# EAGLE design openmv (EAGLE 6.1)
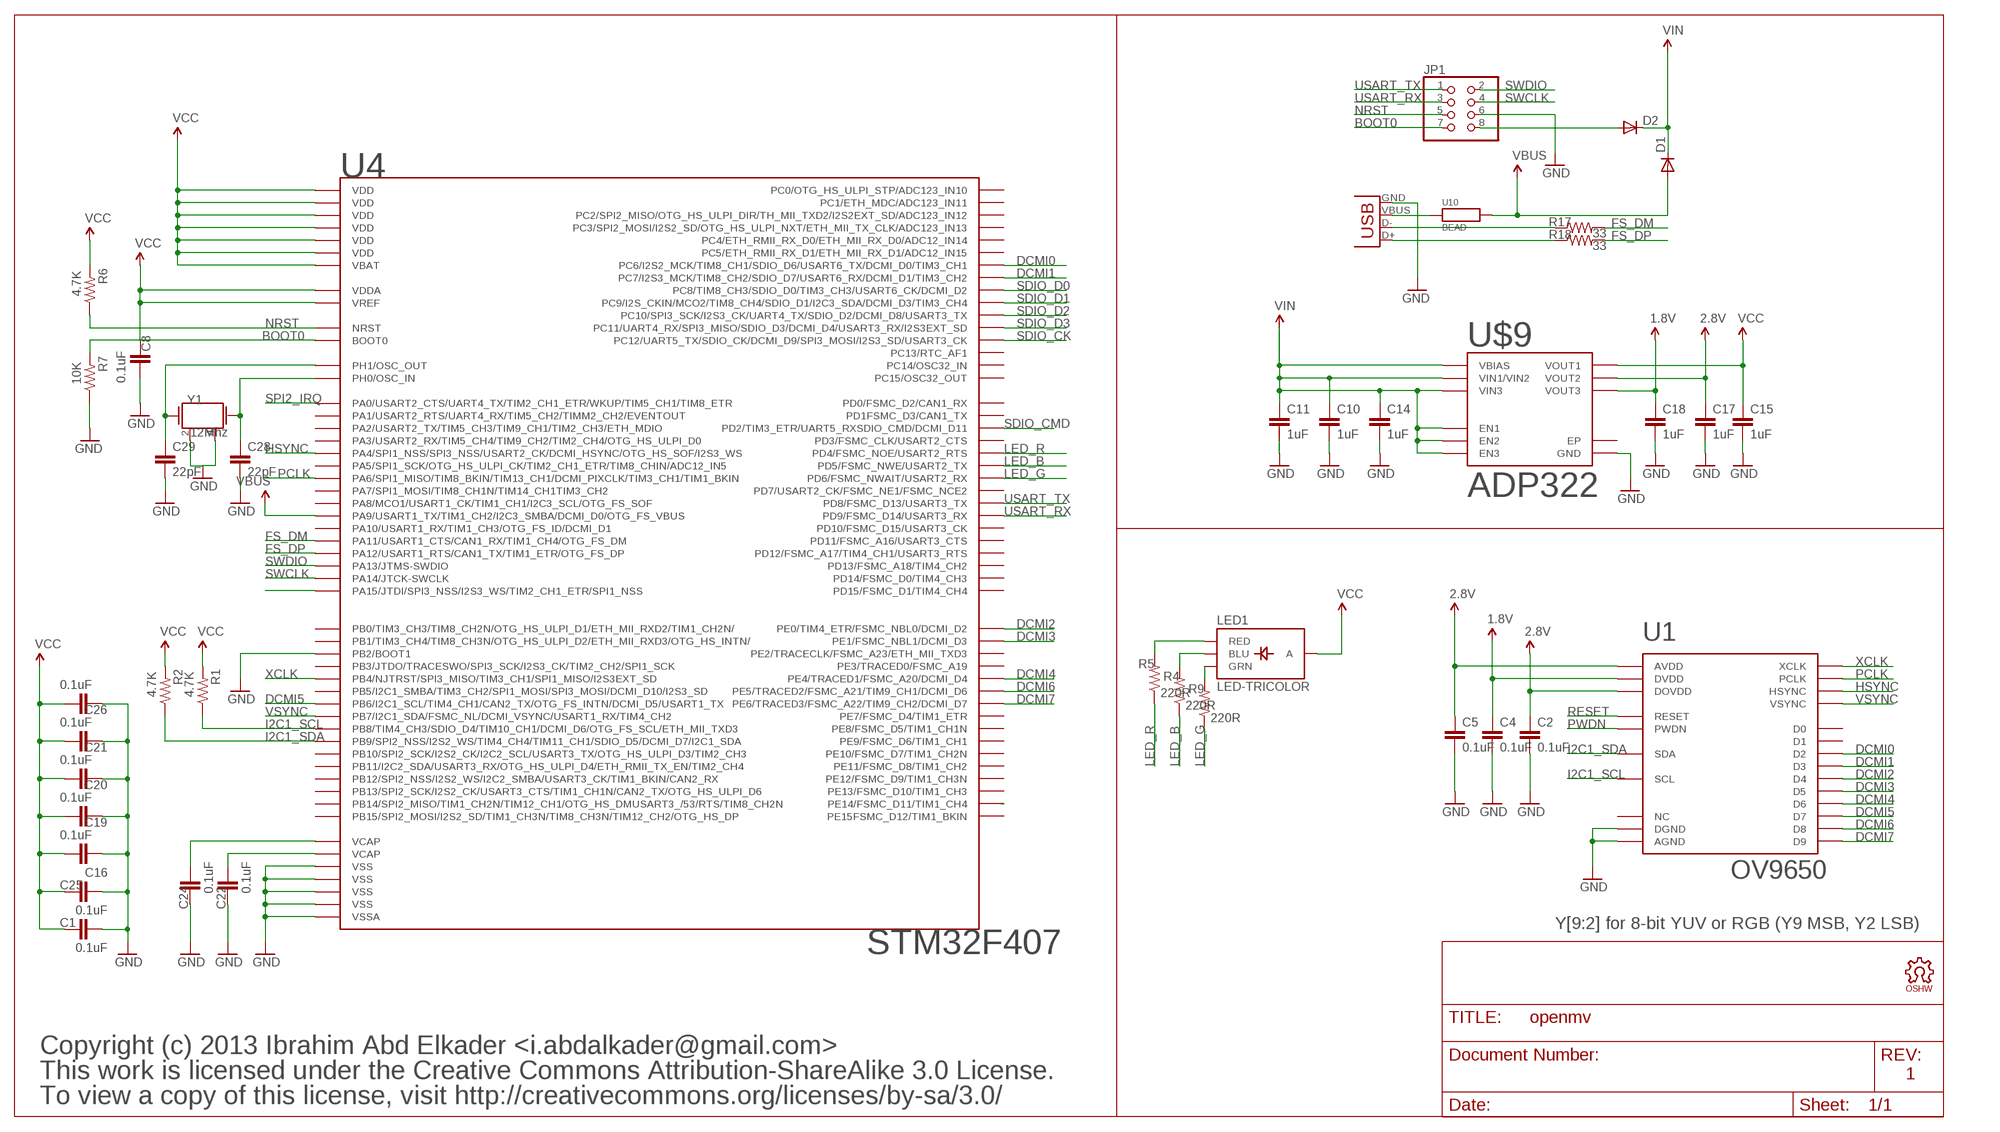
[diagram p0: schematic, sheet 1]

## Parts
C1  0.1uF  CAP0402-CAP  [0402-CAP]
C2  0.1uF  CAP0402-CAP  [0402-CAP]
C4  0.1uF  CAP0402-CAP  [0402-CAP]
C5  0.1uF  CAP0402-CAP  [0402-CAP]
C8  0.1uF  CAP0402-CAP  [0402-CAP]
C10  1uF  CAP0402-CAP  [0402-CAP]
C11  1uF  CAP0402-CAP  [0402-CAP]
C14  1uF  CAP0402-CAP  [0402-CAP]
C15  1uF  CAP0402-CAP  [0402-CAP]
C16  0.1uF  CAP0402-CAP  [0402-CAP]
C17  1uF  CAP0402-CAP  [0402-CAP]
C18  1uF  CAP0402-CAP  [0402-CAP]
C19  0.1uF  CAP0402-CAP  [0402-CAP]
C20  0.1uF  CAP0402-CAP  [0402-CAP]
C21  0.1uF  CAP0402-CAP  [0402-CAP]
C22  0.1uF  CAP0402-CAP  [0402-CAP]
C24  0.1uF  CAP0402-CAP  [0402-CAP]
C25  0.1uF  CAP0402-CAP  [0402-CAP]
C26  0.1uF  CAP0402-CAP  [0402-CAP]
C28  22pF  CAP0402-CAP  [0402-CAP]
C29  22pF  CAP0402-CAP  [0402-CAP]
D1  DIODESOD  [SOD-323]
D2  DIODESOD  [SOD-323]
JP1  PINHD-2X4  [2X04]
LED1  LED-TRICOLOR  [LED-TRICOLOR-SMD]
LOGO2  OSHW_LOGO_FILLX0100-NT  [OSHW_FILLX100_NOTEXT]
R1  4.7K  RESISTOR0402-RES  [0402-RES]
R2  4.7K  RESISTOR0402-RES  [0402-RES]
R4  220R  RESISTOR0402-RES  [0402-RES]
R5  220R  RESISTOR0402-RES  [0402-RES]
R6  4.7K  RESISTOR0402-RES  [0402-RES]
R7  10K  RESISTOR0402-RES  [0402-RES]
R9  220R  RESISTOR0402-RES  [0402-RES]
R17  33  RESISTOR0402-RES  [0402-RES]
R18  33  RESISTOR0402-RES  [0402-RES]
U1  OV9650  [OV9650]
U4  STM32F407  [LQFP100]
U10  BEAD  [0402-CAP]
U$9  ADP322  [WFQFN-16]
X2  USB-MICROB  [USB-MICROB]
Y1  12Mhz  CRYSTAL5X3  [CRYSTAL-SMD-5X3]

## Nets
1.8V: C4.1 C18.1 U1.P$10(DVDD) U$9.8(VOUT3)
2.8V: C2.1 C5.1 C17.1 U1.P$4(AVDD) U1.P$11(DOVDD) U$9.6(VOUT2)
BOOT0: JP1.7 R7.2 U4.94(BOOT0)
DCMI0: U1.P$19(D2) U4.63(PC6/I2S2_MCK/TIM8_CH1/SDIO_D6/USART6_TX/DCMI_D0/TIM3_CH1)
DCMI1: U1.P$21(D3) U4.64(PC7/I2S3_MCK/TIM8_CH2/SDIO_D7/USART6_RX/DCMI_D1/TIM3_CH2)
DCMI2: U1.P$22(D4) U4.97(PE0/TIM4_ETR/FSMC_NBL0/DCMI_D2)
DCMI3: U1.P$20(D5) U4.98(PE1/FSMC_NBL1/DCMI_D3)
DCMI4: U1.P$18(D6) U4.3(PE4/TRACED1/FSMC_A20/DCMI_D4)
DCMI5: U1.P$16(D7) U4.92(PB6/I2C1_SCL/TIM4_CH1/CAN2_TX/OTG_FS_INTN/DCMI_D5/USART1_TX)
DCMI6: U1.P$14(D8) U4.4(PE5/TRACED2/FSMC_A21/TIM9_CH1/DCMI_D6)
DCMI7: U1.P$12(D9) U4.5(PE6/TRACED3/FSMC_A22/TIM9_CH2/DCMI_D7)
FS_DM: R17.2 U4.70(PA11/USART1_CTS/CAN1_RX/TIM1_CH4/OTG_FS_DM)
FS_DP: R18.2 U4.71(PA12/USART1_RTS/CAN1_TX/TIM1_ETR/OTG_FS_DP)
GND: C1.1 C2.2 C4.2 C5.2 C8.1 C10.2 C11.2 C14.2 C15.2 C16.1 C17.2 C18.2 C19.2 C20.2 C21.2 C22.2 C24.2 C25.1 C26.2 C28.2 C29.2 JP1.6 R7.1 U1.P$2(AGND) U1.P$15(DGND) U4.10(VSS) U4.20(VSSA) U4.27(VSS) U4.37(PB2/BOOT1) U4.74(VSS) U4.99(VSS) U$9.12(GND) X2.GND Y1.2 Y1.4
HSYNC: U1.P$9(HSYNC) U4.29(PA4/SPI1_NSS/SPI3_NSS/USART2_CK/DCMI_HSYNC/OTG_HS_SOF/I2S3_WS)
I2C1_SCL: R1.1 U1.P$5(SCL) U4.95(PB8/TIM4_CH3/SDIO_D4/TIM10_CH1/DCMI_D6/OTG_FS_SCL/ETH_MII_TXD3)
I2C1_SDA: R2.1 U1.P$3(SDA) U4.96(PB9/SPI2_NSS/I2S2_WS/TIM4_CH4/TIM11_CH1/SDIO_D5/DCMI_D7/I2C1_SDA)
LED_B: R4.1 U4.86(PD5/FSMC_NWE/USART2_TX)
LED_G: R9.1 U4.87(PD6/FSMC_NWAIT/USART2_RX)
LED_R: R5.1 U4.85(PD4/FSMC_NOE/USART2_RTS)
N$1: D2.2(A) JP1.8
N$2: U4.77(PA15/JTDI/SPI3_NSS/I2S3_WS/TIM2_CH1_ETR/SPI1_NSS)
N$6: LED1.G(GRN) R9.2
N$7: LED1.B(BLU) R4.2
N$9: C29.1 U4.13(PH1/OSC_OUT) Y1.1
N$10: C28.1 U4.12(PH0/OSC_IN) Y1.3
N$16: LED1.R(RED) R5.2
N$18: U4.45(PE14/FSMC_D11/TIM1_CH4)
N$20: R17.1 X2.D-
N$21: R18.1 X2.D+
N$22: U10.1 X2.VBUS
NRST: JP1.5 R6.1 U4.14(NRST)
PCLK: U1.P$17(PCLK) U4.31(PA6/SPI1_MISO/TIM8_BKIN/TIM13_CH1/DCMI_PIXCLK/TIM3_CH1/TIM1_BKIN)
PWDN: U1.P$8(PWDN)
RESET: U1.P$6(RESET)
SDIO_CK: U4.80(PC12/UART5_TX/SDIO_CK/DCMI_D9/SPI3_MOSI/I2S3_SD/USART3_CK)
SDIO_CMD: U4.83(PD2/TIM3_ETR/UART5_RXSDIO_CMD/DCMI_D11)
SDIO_D0: U4.65(PC8/TIM8_CH3/SDIO_D0/TIM3_CH3/USART6_CK/DCMI_D2)
SDIO_D1: U4.66(PC9/I2S_CKIN/MCO2/TIM8_CH4/SDIO_D1/I2C3_SDA/DCMI_D3/TIM3_CH4)
SDIO_D2: U4.78(PC10/SPI3_SCK/I2S3_CK/UART4_TX/SDIO_D2/DCMI_D8/USART3_TX)
SDIO_D3: U4.79(PC11/UART4_RX/SPI3_MISO/SDIO_D3/DCMI_D4/USART3_RX/I2S3EXT_SD)
SPI2_IRQ: U4.23(PA0/USART2_CTS/UART4_TX/TIM2_CH1_ETR/WKUP/TIM5_CH1/TIM8_ETR)
SWCLK: JP1.4 U4.76(PA14/JTCK-SWCLK)
SWDIO: JP1.2 U4.72(PA13/JTMS-SWDIO)
USART_RX: JP1.3 U4.56(PD9/FSMC_D14/USART3_RX)
USART_TX: JP1.1 U4.55(PD8/FSMC_D13/USART3_TX)
VBUS: D1.2(A) U4.68(PA9/USART1_TX/TIM1_CH2/I2C3_SMBA/DCMI_D0/OTG_FS_VBUS) U10.2
VCAP1: C24.1 U4.49(VCAP)
VCAP2: C22.1 U4.73(VCAP)
VCC: C1.2 C8.2 C15.1 C16.2 C19.1 C20.1 C21.1 C25.2 C26.1 LED1.A R1.2 R2.2 R6.2 U4.6(VBAT) U4.11(VDD) U4.19(VDD) U4.21(VREF) U4.22(VDDA) U4.28(VDD) U4.50(VDD) U4.75(VDD) U4.100(VDD) U$9.5(VOUT1)
VIN: C10.1 C11.1 C14.1 D1.1(C) D2.1(C) U$9.1(EN1) U$9.2(VBIAS) U$9.3(VIN1/VIN2) U$9.10(VIN3) U$9.15(EN3) U$9.16(EN2)
VSYNC: U1.P$7(VSYNC) U4.93(PB7/I2C1_SDA/FSMC_NL/DCMI_VSYNC/USART1_RX/TIM4_CH2)
XCLK: U1.P$13(XCLK) U4.90(PB4/NJTRST/SPI3_MISO/TIM3_CH1/SPI1_MISO/I2S3EXT_SD)
Unconnected: U1.P$1(NC) U1.P$23(D1) U1.P$24(D0) U4.1(PE2/TRACECLK/FSMC_A23/ETH_MII_TXD3) U4.2(PE3/TRACED0/FSMC_A19) U4.7(PC13/RTC_AF1) U4.8(PC14/OSC32_IN) U4.9(PC15/OSC32_OUT) U4.15(PC0/OTG_HS_ULPI_STP/ADC123_IN10) U4.16(PC1/ETH_MDC/ADC123_IN11) U4.17(PC2/SPI2_MISO/OTG_HS_ULPI_DIR/TH_MII_TXD2/I2S2EXT_SD/ADC123_IN12) U4.18(PC3/SPI2_MOSI/I2S2_SD/OTG_HS_ULPI_NXT/ETH_MII_TX_CLK/ADC123_IN13) U4.24(PA1/USART2_RTS/UART4_RX/TIM5_CH2/TIMM2_CH2/EVENTOUT) U4.25(PA2/USART2_TX/TIM5_CH3/TIM9_CH1/TIM2_CH3/ETH_MDIO) U4.26(PA3/USART2_RX/TIM5_CH4/TIM9_CH2/TIM2_CH4/OTG_HS_ULPI_D0) U4.30(PA5/SPI1_SCK/OTG_HS_ULPI_CK/TIM2_CH1_ETR/TIM8_CHIN/ADC12_IN5) U4.32(PA7/SPI1_MOSI/TIM8_CH1N/TIM14_CH1TIM3_CH2) U4.33(PC4/ETH_RMII_RX_D0/ETH_MII_RX_D0/ADC12_IN14) U4.34(PC5/ETH_RMII_RX_D1/ETH_MII_RX_D1/ADC12_IN15) U4.35(PB0/TIM3_CH3/TIM8_CH2N/OTG_HS_ULPI_D1/ETH_MII_RXD2/TIM1_CH2N/) U4.36(PB1/TIM3_CH4/TIM8_CH3N/OTG_HS_ULPI_D2/ETH_MII_RXD3/OTG_HS_INTN/) U4.38(PE7/FSMC_D4/TIM1_ETR) U4.39(PE8/FSMC_D5/TIM1_CH1N) U4.40(PE9/FSMC_D6/TIM1_CH1) U4.41(PE10/FSMC_D7/TIM1_CH2N) U4.42(PE11/FSMC_D8/TIM1_CH2) U4.43(PE12/FSMC_D9/TIM1_CH3N) U4.44(PE13/FSMC_D10/TIM1_CH3) U4.46(PE15FSMC_D12/TIM1_BKIN) U4.47(PB10/SPI2_SCK/I2S2_CK/I2C2_SCL/USART3_TX/OTG_HS_ULPI_D3/TIM2_CH3) U4.48(PB11/I2C2_SDA/USART3_RX/OTG_HS_ULPI_D4/ETH_RMII_TX_EN/TIM2_CH4) U4.51(PB12/SPI2_NSS/I2S2_WS/I2C2_SMBA/USART3_CK/TIM1_BKIN/CAN2_RX) U4.52(PB13/SPI2_SCK/I2S2_CK/USART3_CTS/TIM1_CH1N/CAN2_TX/OTG_HS_ULPI_D6) U4.53(PB14/SPI2_MISO/TIM1_CH2N/TIM12_CH1/OTG_HS_DMUSART3_/53/RTS/TIM8_CH2N) U4.54(PB15/SPI2_MOSI/I2S2_SD/TIM1_CH3N/TIM8_CH3N/TIM12_CH2/OTG_HS_DP) U4.57(PD10/FSMC_D15/USART3_CK) U4.58(PD11/FSMC_A16/USART3_CTS) U4.59(PD12/FSMC_A17/TIM4_CH1/USART3_RTS) U4.60(PD13/FSMC_A18/TIM4_CH2) U4.61(PD14/FSMC_D0/TIM4_CH3) U4.62(PD15/FSMC_D1/TIM4_CH4) U4.67(PA8/MCO1/USART1_CK/TIM1_CH1/I2C3_SCL/OTG_FS_SOF) U4.69(PA10/USART1_RX/TIM1_CH3/OTG_FS_ID/DCMI_D1) U4.81(PD0/FSMC_D2/CAN1_RX) U4.82(PD1FSMC_D3/CAN1_TX) U4.84(PD3/FSMC_CLK/USART2_CTS) U4.88(PD7/USART2_CK/FSMC_NE1/FSMC_NCE2) U4.89(PB3/JTDO/TRACESWO/SPI3_SCK/I2S3_CK/TIM2_CH2/SPI1_SCK) U4.91(PB5/I2C1_SMBA/TIM3_CH2/SPI1_MOSI/SPI3_MOSI/DCMI_D10/I2S3_SD) U$9.4(NC) U$9.7(NC) U$9.9(NC) U$9.11(NC) U$9.13(NC) U$9.14(NC) U$9.EXP(EP)

## Notes on the sheet
- Y[9:2] for 8-bit YUV or RGB (Y9 MSB, Y2 LSB)
- Copyright (c) 2013 Ibrahim Abd Elkader <i.abdalkader@gmail.com>
- This work is licensed under the Creative Commons Attribution-ShareAlike 3.0 License. | 1
- To view a copy of this license, visit http://creativecommons.org/licenses/by-sa/3.0/

## Library data of the parts
C1 C2 C4 C5 C8 C10 C11 C14-C22 C24-C26 C28 C29 = sfe:CAP: Capacitor Standard 0603 ceramic capacitor, and 0.1" leaded capacitor.
D1 D2 = sfe:DIODE: Diode These are standard reverse protection diodes and small signal diodes. SMA package can handle up to about 1A. SOD-323 can handle about 200mA. What the SOD-323 package when ordering, there are some mfgs out there that are 5-pin packages.
JP1 = pinhead:PINHD-2X4: PIN HEADER
LED1 = sfe:LED-TRICOLOR: Tri-Color LED SMD Proven layout and schematic for triple color LED in SMD package - common anode. Spark Fun Electronics SKU : COM-07844
LOGO2 = iofault:OSHW_LOGO_FILL
R1 R2 R4-R7 R9 R17 R18 = sfe:RESISTOR: Resistor Basic schematic elements and footprints for 0603, 1206, and PTH resistors.
U1 = iofault:OV9650
U4 = mux:STM32F407
U10 = heka:BEAD
U$9 = iofault:ADP322
X2 = sfe:USB: USB Connectors USB-B-PTH is fully proven SKU : PRT-00139 USB-miniB is fully proven SKU : PRT-00587 USB-A-PCB is untested. USB-A-H is throughly reviewed, but untested. Spark Fun Electronics SKU : PRT-00437 USB-B-SMT is throughly reviewed, but untested. Needs silkscreen touching up. USB-A-S has not been used/tested USB-MB-H has not been used/tested
Y1 = mux:CRYSTAL: Crystals Various standard crystals. Proven footprints. Spark Fun Electronics SKU : COM-00534

## Board
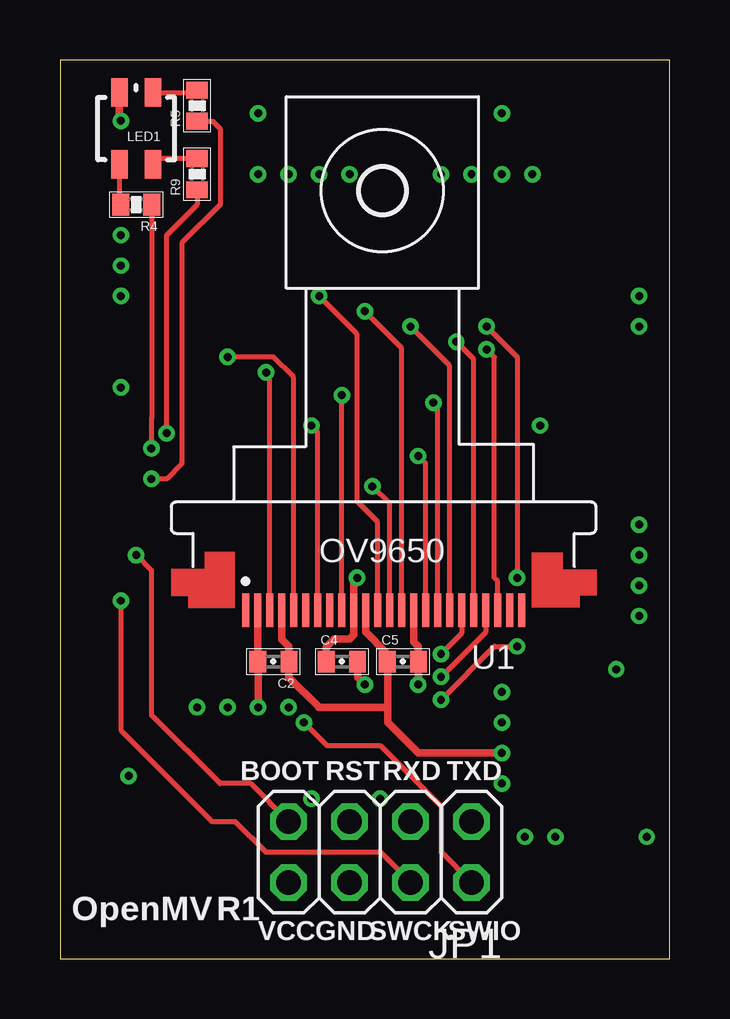
[diagram p1: board, top side]
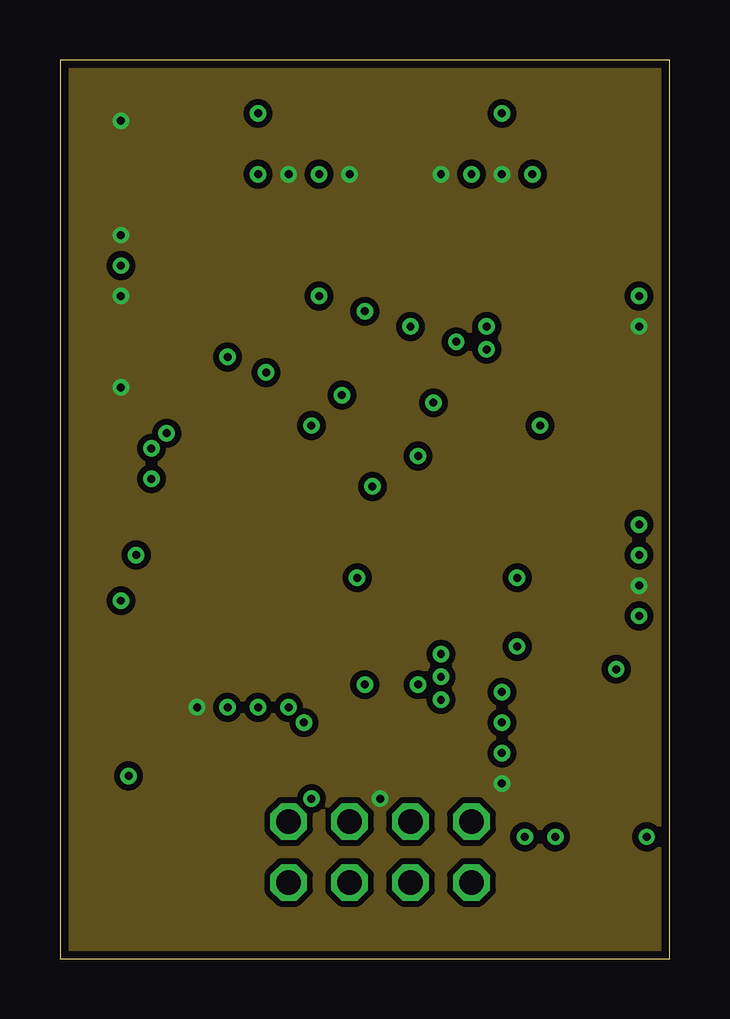
[diagram p2: board, inner layer Route2]
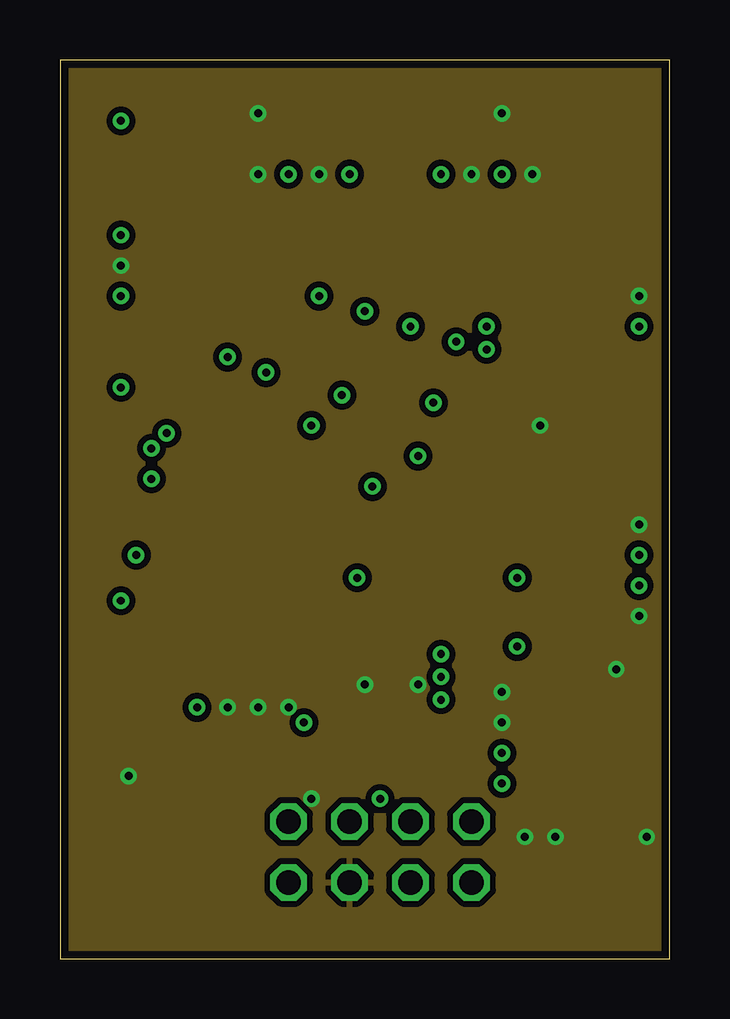
[diagram p3: board, inner layer Route15]
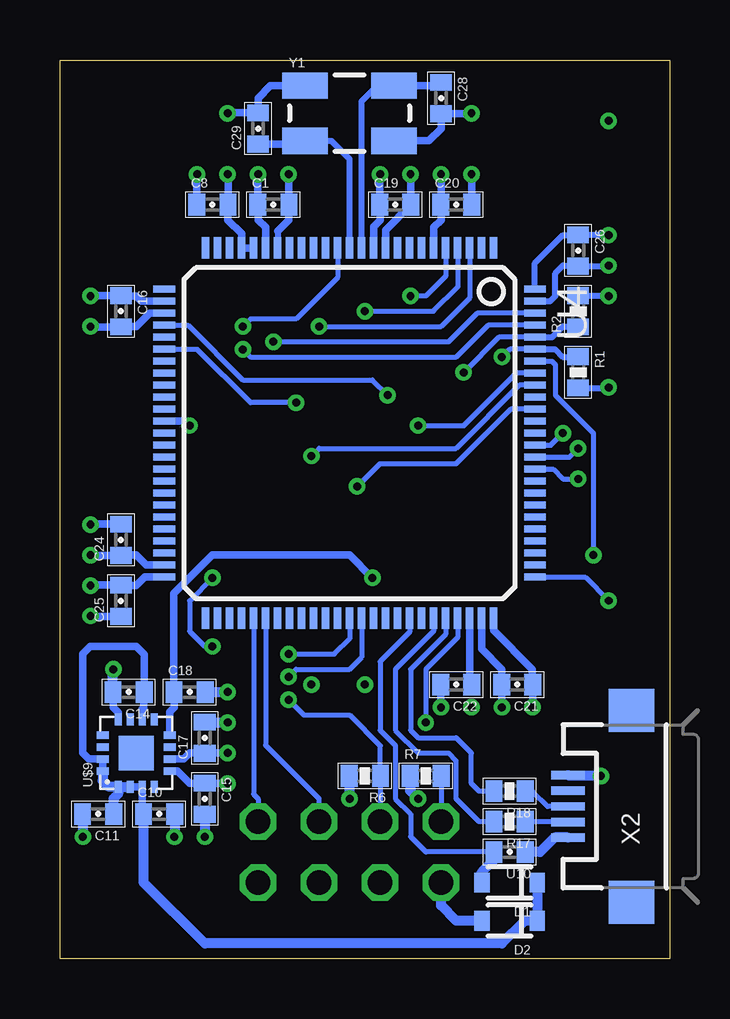
[diagram p4: board, bottom side, seen from below]

Size 25.4 x 37.47 mm. Coordinates in mm from the lower left corner, seen from the top.
Outline: 0,0 25.4,0 25.4,37.47 0,37.47 0,0
Copper layers (1*2+15*16): Top 0.035mm / dielectric 1.5mm / Route2 0.035mm / dielectric 0.15mm / Route15 0.035mm / dielectric 0.2mm / Bottom 0.035mm
Design rules: minimum track width 8mil, minimum drill 13mil, track to track 6mil, track to pad 6mil, pad to pad 6mil, via to via 6mil, smd to smd 6mil, copper to edge 13mil, drill to drill 13mil, minimum pad ring 10mil, minimum via ring 7mil, stop-mask expansion 2mil, vias tented up to drill 20mil, thermal gap 10mil

### Footprints (pad centres in the part's own frame; a part is rotated, then mirrored left to right if it is on the bottom)
0402-CAP = smd 0.7 x 0.9: 1 -0.65,0; 2 0.65,0
SOD-323 = smd 0.63 x 0.83: 1 -1.15,0; 2 1.15,0
2X04 = drill 1.016 octagon: 1 -3.81,-1.27; 2 -3.81,1.27; 3 -1.27,-1.27; 4 -1.27,1.27; 5 1.27,-1.27; 6 1.27,1.27; 7 3.81,-1.27; 8 3.81,1.27
LED-TRICOLOR-SMD = smd 0.7 x 1.2: A 0.7,-1.5; B 0.7,1.5; G -0.7,1.5; R -0.7,-1.5
0402-RES = smd 0.7 x 0.9: 1 -0.65,0; 2 0.65,0
OV9650 = smd 0.3 x 1.4: P$1 -5.6,-11.5; P$2 -5.1,-11.5; P$3 -4.6,-11.5; P$4 -4.1,-11.5; P$5 -3.6,-11.5; P$6 -3.1,-11.5; P$7 -2.6,-11.5; P$8 -2.1,-11.5; P$9 -1.6,-11.5; P$10 -1.1,-11.5; P$11 -0.6,-11.5; P$12 -0.1,-11.5; P$13 0.4,-11.5; P$14 0.9,-11.5; P$15 1.4,-11.5; P$16 1.9,-11.5; P$17 2.4,-11.5; P$18 2.9,-11.5; P$19 3.4,-11.5; P$20 3.9,-11.5; P$21 4.4,-11.5; P$22 4.9,-11.5; P$23 5.4,-11.5; P$24 5.9,-11.5
LQFP100 = smd 0.9 x 0.3: 1 -7.72,6; 2 -7.72,5.5; 3 -7.72,5; 4 -7.72,4.5; 5 -7.72,4; 6 -7.72,3.5; 7 -7.72,3; 8 -7.72,2.5; 9 -7.72,2; 10 -7.72,1.5; 11 -7.72,1; 12 -7.72,0.5; 13 -7.72,0; 14 -7.72,-0.5; 15 -7.72,-1; 16 -7.72,-1.5; 17 -7.72,-2; 18 -7.72,-2.5; 19 -7.72,-3; 20 -7.72,-3.5; 21 -7.72,-4; 22 -7.72,-4.5; 23 -7.72,-5; 24 -7.72,-5.5; 25 -7.72,-6; 51 7.72,-6; 52 7.72,-5.5; 53 7.72,-5; 54 7.72,-4.5; 55 7.72,-4; 56 7.72,-3.5; 57 7.72,-3; 58 7.72,-2.5; 59 7.72,-2; 60 7.72,-1.5; 61 7.72,-1; 62 7.72,-0.5; 63 7.72,0; 64 7.72,0.5; 65 7.72,1; 66 7.72,1.5; 67 7.72,2; 68 7.72,2.5; 69 7.72,3; 70 7.72,3.5; 71 7.72,4; 72 7.72,4.5; 73 7.72,5; 74 7.72,5.5; 75 7.72,6 | smd 0.3 x 0.9: 26 -6,-7.72; 27 -5.5,-7.72; 28 -5,-7.72; 29 -4.5,-7.72; 30 -4,-7.72; 31 -3.5,-7.72; 32 -3,-7.72; 33 -2.5,-7.72; 34 -2,-7.72; 35 -1.5,-7.72; 36 -1,-7.72; 37 -0.5,-7.72; 38 0,-7.72; 39 0.5,-7.72; 40 1,-7.72; 41 1.5,-7.72; 42 2,-7.72; 43 2.5,-7.72; 44 3,-7.72; 45 3.5,-7.72; 46 4,-7.72; 47 4.5,-7.72; 48 5,-7.72; 49 5.5,-7.72; 50 6,-7.72; 76 6,7.72; 77 5.5,7.72; 78 5,7.72; 79 4.5,7.72; 80 4,7.72; 81 3.5,7.72; 82 3,7.72; 83 2.5,7.72; 84 2,7.72; 85 1.5,7.72; 86 1,7.72; 87 0.5,7.72; 88 0,7.72; 89 -0.5,7.72; 90 -1,7.72; 91 -1.5,7.72; 92 -2,7.72; 93 -2.5,7.72; 94 -3,7.72; 95 -3.5,7.72; 96 -4,7.72; 97 -4.5,7.72; 98 -5,7.72; 99 -5.5,7.72; 100 -6,7.72
WFQFN-16 = smd 0.5 x 0.3: 1 -1.4,0.75; 2 -1.4,0.25; 3 -1.4,-0.25; 4 -1.4,-0.75; 9 1.4,-0.75; 10 1.4,-0.25; 11 1.4,0.25; 12 1.4,0.75 | smd 0.3 x 0.5: 5 -0.75,-1.4; 6 -0.25,-1.4; 7 0.25,-1.4; 8 0.75,-1.4; 13 0.75,1.4; 14 0.25,1.4; 15 -0.25,1.4; 16 -0.75,1.4 | smd 1.45 x 1.45: EXP 0,0
USB-MICROB = smd 0.35 x 1.4: D+ 0,2.65; D- -0.65,2.65; GND 1.3,2.65; ID 0.65,2.65; VBUS -1.3,2.65 | smd 1.8 x 1.9: MT1 -4,0; MT2 4,0
CRYSTAL-SMD-5X3 = smd 1.9 x 1.1: 1 -1.85,-1.15; 2 1.85,-1.15; 3 1.85,1.15; 4 -1.85,1.15

### Placement (x,y rotation side)
C1  16.51,31.43 0 bottom
C2  8.89,12.38 180 top
C4  11.75,12.38 0 top
C5  14.29,12.38 0 top
C8  19.05,31.43 0 bottom
C10  21.27,6.03 0 bottom
C11  23.81,6.03 180 bottom
C14  22.54,11.11 180 bottom
C15  19.37,6.67 270 bottom
C16  22.86,26.99 270 bottom
C17  19.37,9.21 90 bottom
C18  20,11.11 0 bottom
C19  11.43,31.43 0 bottom
C20  8.89,31.43 0 bottom
C21  6.35,11.43 180 bottom
C22  8.89,11.43 180 bottom
C24  22.86,17.46 90 bottom
C25  22.86,14.92 90 bottom
C26  3.81,29.53 270 bottom
C28  9.53,35.88 270 bottom
C29  17.14,34.61 90 bottom
D1  6.67,3.17 180 bottom
D2  6.67,1.59 180 bottom
JP1  13.34,4.45 180 top
LED1  3.17,34.61 180 top
LOGO2  -0.95,-9.53 0 top  (outside the outline)
R1  3.81,24.45 270 bottom
R2  3.81,26.99 90 bottom
R4  3.17,31.43 180 top
R5  5.71,35.56 90 top
R6  12.7,7.62 180 bottom
R7  10.16,7.62 0 bottom
R9  5.71,32.7 90 top
R17  6.67,5.71 180 bottom
R18  6.67,6.99 180 bottom
U1  13.34,26.04 0 top
U4  13.34,21.91 270 bottom
U10  6.67,4.45 180 bottom
U$9  22.23,8.57 90 bottom
X2  1.59,6.35 90 bottom
Y1  13.34,35.24 0 bottom

### Tracks (layer width: path | path; a pad name or v marks a point on that pad's centre or on a via)
1.8V  (via drill 0.33)
  Top 0.305: v12.38,15.88 12.23,15.73 U1.P$10 12.23,13.51 12.06,13.34 11.43,13.34 11.1,13 C4.1
  Bottom 0.305: U$9.8 20.82,10.29 20.64,10.48 20.64,11.1 C18.1 20.65,15.22 19.05,16.83 13.34,16.83 v12.38,15.88
2.8V  (via drill 0.33)
  Top 0.305: 13.64,10.49 13.65,10.48 | v18.41,8.57 14.92,8.57 13.65,9.84 13.65,10.48 | 10.79,10.48 9.54,11.73 C2.1 9.53,12.4 9.53,13.02 9.23,13.31 U1.P$4 | 10.79,10.48 10.78,10.48 | 10.79,10.48 13.65,10.48 | U1.P$11 12.73,13.62 13.64,12.71 C5.1 13.65,12.37 13.65,10.48
  Bottom 0.254: 19.38,8.57 C17.1
  Bottom 0.305: U$9.6 20.25,8.32 20,8.57 19.38,8.57 v18.41,8.57
BOOT0  (via drill 0.33)
  Top 0.203: JP1.7 7.94,7.3 6.67,7.3 3.81,10.16 3.81,16.19 v3.17,16.83
  Bottom 0.203: U4.94 4.91,24.91 4.76,24.77 4.76,23.5 3.17,21.91 v3.17,16.83 | R7.2 9.51,5.73 JP1.7
DCMI0  (via drill 0.33)
  Top 0.203: v15.88,12.7 16.73,13.56 U1.P$19
  Bottom 0.203: v15.88,12.7 13.97,12.7 13.34,13.34 U4.63
DCMI1  (via drill 0.33)
  Top 0.203: v15.88,11.75 17.73,13.61 U1.P$21
  Bottom 0.203: v15.88,11.75 15.56,12.06 13.34,12.06 12.84,12.56 U4.64
DCMI2  (via drill 0.33)
  Top 0.203: U1.P$22 18.23,15.74 18.1,15.88 18.1,25.08 v17.78,25.4
  Bottom 0.203: v17.78,25.4 17.46,25.08 8.89,25.08 7.57,26.41 U4.97
DCMI3  (via drill 0.33)
  Top 0.203: U1.P$20 17.23,24.99 v16.51,25.72
  Bottom 0.203: v16.51,25.72 9.21,25.72 8.02,26.91 U4.98
DCMI4  (via drill 0.33)
  Top 0.203: U1.P$18 16.23,24.72 v14.61,26.35
  Bottom 0.203: v14.61,26.35 9.53,26.35 8.34,27.54 U4.3
DCMI5  (via drill 0.33)
  Top 0.203: v14.92,20.95 15.23,20.64 U1.P$16
  Bottom 0.203: v14.92,20.95 14.61,21.27 8.89,21.27 6.25,23.91 U4.92
DCMI6  (via drill 0.33)
  Top 0.203: v12.7,26.99 14.23,25.45 U1.P$14
  Bottom 0.203: v12.7,26.99 9.84,26.99 8.84,28 U4.4
DCMI7  (via drill 0.33)
  Top 0.203: v10.79,27.62 12.38,26.04 12.38,19.05 13.23,18.2 U1.P$12
  Bottom 0.203: U4.5 9.34,28.45 10.16,27.62 v10.79,27.62
FS_DM
  Bottom 0.203: U4.70 9.84,13.66 11.43,12.06 11.43,9.53 10.48,8.57 9.21,8.57 8.89,8.26 8.89,6.67 7.94,5.71 R17.2
FS_DP
  Bottom 0.203: U4.71 9.34,13.53 10.79,12.06 10.79,9.53 10.48,9.21 8.89,9.21 8.26,8.57 8.26,7.3 7.94,6.99 R18.2
GND  (via drill 0.33)
  Top 0.305: C2.2 8.26,12.4 8.26,12.38 | 8.26,12.38 v8.26,10.48 | C4.2 12.4,11.73 v12.7,11.43 | U1.P$2 8.23,12.4 8.26,12.38 | U1.P$15 14.73,13.21 14.92,13.02 14.92,12.4 | 14.92,12.4 C5.2 | 14.92,12.4 v14.92,11.43
  Bottom 0.254: U4.99 4.98,27.41 4.76,27.62 4.76,28.57 4.45,28.89 3.83,28.89 C26.2 2.56,28.88 v2.54,28.89
  Bottom 0.305: U4.27 22.01,27.41 22.23,27.62 22.84,27.62 C16.1 24.11,27.64 v24.13,27.62 | C25.1 24.11,14.27 v24.13,14.29 | C24.2 24.11,18.11 v24.13,18.1 | v6.99,10.48 7,10.49 C21.2 6.99,11.45 6.99,12.06 7.83,12.91 U4.74 | v10.79,32.7 10.78,32.69 C19.2 11.84,30.38 U4.10 | C20.2 8.24,32.69 v8.26,32.7 | C8.1 19.7,32.69 v19.68,32.7 | v17.14,32.7 17.16,32.69 C1.1 17.14,31.42 17.14,30.8 16.84,30.49 U4.20 | U4.37 20.18,22.41 v20,22.23 | v8.26,35.24 8.27,35.23 C28.2 9.53,34.61 10.04,34.09 Y1.2 | Y1.4 16.63,36.39 17.14,35.88 C29.2 18.4,35.26 v18.41,35.24 | U$9.12 22.98,10.28 23.18,10.48 23.18,11.1 C14.2 | C22.2 9.54,10.49 v9.53,10.48
  Bottom 0.406: C11.2 24.46,5.09 v24.45,5.08 | C10.2 20.62,5.09 v20.64,5.08 | C15.2 v19.37,5.08 | C17.2 18.43,9.86 v18.41,9.84 | C14.2 23.19,12.05 v23.18,12.06 | X2.GND 2.89,7.65 v2.86,7.62 | R7.1 10.81,7 v10.48,6.67 | C18.2 v18.41,11.11
  pour Route15 (isolate 0.254): 0,0 0,37.47 25.4,37.47 25.4,0
HSYNC  (via drill 0.33)
  Top 0.203: U1.P$9 11.73,23.48 v11.75,23.5
  Bottom 0.203: U4.29 20.06,26.41 17.78,24.13 12.38,24.13 v11.75,23.5
I2C1_SCL  (via drill 0.33)
  Top 0.203: v6.99,25.08 8.89,25.08 9.73,24.24 U1.P$5
  Bottom 0.203: U4.95 6.66,25.41 v6.99,25.08
  Bottom 0.254: U4.95 4.77,25.41 4.45,25.08 3.83,25.08 R1.1
I2C1_SDA  (via drill 0.33)
  Top 0.203: U1.P$3 8.73,24.29 v8.59,24.43
  Bottom 0.203: U4.96 7.11,25.91 v8.59,24.43
  Bottom 0.254: U4.96 4.89,25.91 4.45,26.35 3.83,26.35 R2.1
LED_B  (via drill 0.33)
  Top 0.203: R4.1 3.83,22.56 3.81,22.54 v3.81,21.27
  Bottom 0.203: U4.86 4.17,20.91 v3.81,21.27
LED_G  (via drill 0.33)
  Top 0.203: v4.45,21.91 4.45,30.16 5.71,31.43 R9.1
  Bottom 0.203: U4.87 4.95,21.41 v4.45,21.91
LED_R  (via drill 0.33)
  Top 0.203: R5.1 6.37,34.91 6.67,34.61 6.67,31.43 5.08,29.84 5.08,20.64 4.45,20 v3.81,20
  Bottom 0.203: U4.85 4.85,20.41 4.45,20 v3.81,20
N$1
  Bottom 0.406: D2.2 8.89,1.59 9.53,2.22 JP1.8
N$6
  Top 0.203: R9.2 4.12,33.35 LED1.G
N$7
  Top 0.203: LED1.B 2.48,31.48 R4.2
N$9
  Bottom 0.254: U4.13 13.34,33.34 14.09,34.09 Y1.1
  Bottom 0.305: C29.1 15.32,33.96 Y1.1
N$10
  Bottom 0.254: Y1.3 12.19,36.39 12.84,35.74 U4.12
  Bottom 0.305: Y1.3 9.66,36.39 C28.1
N$16
  Top 0.203: LED1.R 5.61,36.11 R5.2
N$20
  Bottom 0.203: X2.D- 6,5.7 R17.1
N$21
  Bottom 0.203: X2.D+ 5.08,6.35 5.71,6.99 R18.1
N$22
  Bottom 0.406: X2.VBUS 4.79,5.05 5.4,4.45 U10.1
NRST  (via drill 0.33)
  Top 0.203: v17.78,26.35 19.05,25.08 v19.05,15.88 | v15.88,10.79 18.1,13.02 v19.05,13.02
  Bottom 0.203: U4.14 13.84,28.39 15.56,26.67 17.46,26.67 v17.78,26.35 | v15.88,10.79 15.24,10.16 13.34,10.16 12.05,8.88 R6.1 12.05,5.73 JP1.5 | v19.05,15.88 20,14.92 20,13.65 19.37,13.02 v19.05,13.02
PCLK  (via drill 0.33)
  Top 0.203: U1.P$17 15.73,23 v15.56,23.18
  Bottom 0.203: v15.56,23.18 17.46,23.18 19.69,25.41 U4.31
SWCLK  (via drill 0.33)
  Top 0.203: JP1.4 13.34,4.45 8.57,4.45 7.3,5.71 6.35,5.71 2.54,9.53 v2.54,14.92
  Bottom 0.203: U4.76 3.52,15.91 v2.54,14.92
SWDIO  (via drill 0.33)
  Top 0.203: JP1.2 15.88,4.45 15.88,6.35 13.34,8.89 11.11,8.89 v10.16,9.84
  Bottom 0.203: U4.72 8.84,13.39 10.16,12.06 v10.16,9.84
USART_RX
  Bottom 0.203: JP1.3 14.61,6.67 16.84,8.9 U4.56
USART_TX
  Bottom 0.203: U4.55 17.34,6.86 17.14,6.67 JP1.1
VBUS
  Bottom 0.203: U4.68 10.84,13.61 12.06,12.38 12.06,9.53 11.43,8.89 11.43,6.67 10.79,6.03 10.79,5.08 10.16,4.45 U10.2
  Bottom 0.406: U10.2 7.32,4.11 7.82,3.61 D1.2
VCAP1  (via drill 0.33)
  Bottom 0.305: v24.13,16.83 24.11,16.81 C24.1 22.84,16.83 22.23,16.83 21.8,16.41 U4.49
VCAP2
  Bottom 0.305: U4.73 8.34,11.53 C22.1
VCC  (via drill 0.33)
  Top 0.305: LED1.A 2.48,34.99 v2.54,34.92
  Bottom 0.254: U4.100 5.62,28.99 4.45,30.16 3.83,30.16 C26.1 2.56,30.18 v2.54,30.16 | R1.2 2.56,23.8 v2.54,23.81 | R2.2 2.56,27.64 v2.54,27.62 | 16.34,30.34 U4.19
  Bottom 0.305: v18.41,32.7 18.4,32.69 C8.2 18.41,31.42 18.41,30.8 17.84,30.22 U4.22 U4.21 | 9.53,31.42 C20.1 | v24.13,26.35 24.11,26.34 C16.2 22.84,26.35 22.23,26.35 21.67,26.91 U4.28 | v24.13,15.56 24.11,15.57 C25.2 22.84,15.56 22.23,15.56 21.88,15.91 U4.50 | v12.06,32.7 12.08,32.69 C19.1 12.06,31.42 12.06,30.8 12.34,30.53 U4.11 | 9.53,31.42 v9.53,32.7 | 9.53,31.42 9.53,30.8 9.84,30.49 U4.6 | v15.88,32.7 15.86,32.69 C1.2 15.88,31.42 15.88,30.8 16.34,30.34 | U$9.5 20.52,7.82 20,7.3 19.38,7.3 C15.1 18.43,7.32 v18.41,7.3 | v5.71,10.48 5.7,10.49 C21.1 5.71,11.45 5.71,12.06 7.33,13.69 U4.75
  Bottom 0.406: R6.2 13.35,6.68 v13.34,6.67
  pour Route2 (isolate 0.254): 0,0 0,37.47 25.4,37.47 25.4,0
VIN
  Bottom 0.305: U$9.2 U$9.3 21.98,6.08 | U$9.16 U$9.15 24.2,8.32 24.45,8.57 24.45,12.7 24.13,13.02 22.23,13.02 21.89,12.69 C14.1 21.91,11.1 21.91,10.48 21.98,10.41 U$9.10
  Bottom 0.406: U$9.1 22.98,6.87 23.18,6.67 23.18,6.05 C11.1 | U$9.1 U$9.2 | 21.98,6.08 C10.1 21.92,3.19 19.37,0.64 6.99,0.64 6.03,1.59 D2.1 D1.1 | U$9.1 23.36,7.17 23.62,7.43 U$9.16
VSYNC  (via drill 0.33)
  Top 0.203: U1.P$7 10.73,21.97 v10.48,22.23
  Bottom 0.203: v10.48,22.23 8.57,22.23 6.39,24.41 U4.93
XCLK  (via drill 0.33)
  Top 0.203: U1.P$13 13.73,18.97 v13.02,19.68
  Bottom 0.203: v13.02,19.68 12.06,20.64 8.89,20.64 6.62,22.91 U4.90

### Text on the board
tPlace: BOOT | RST | RXD | TXD | OpenMV | R1 | VCC | GND | SWCK | SWIO